# EasyEDA Pro project USB_TTL_CH340B.eprj

# Schematic Schematic1
Board Name: Board1; Create Date: 2024-12-27; Page Name: P1; Project Name: USB_TTL_CH340B; Schematic Name: Schematic1; Update Date: 2024-12-27; Company: 嘉立创EDA; Page Size: A4; Version: V1.0
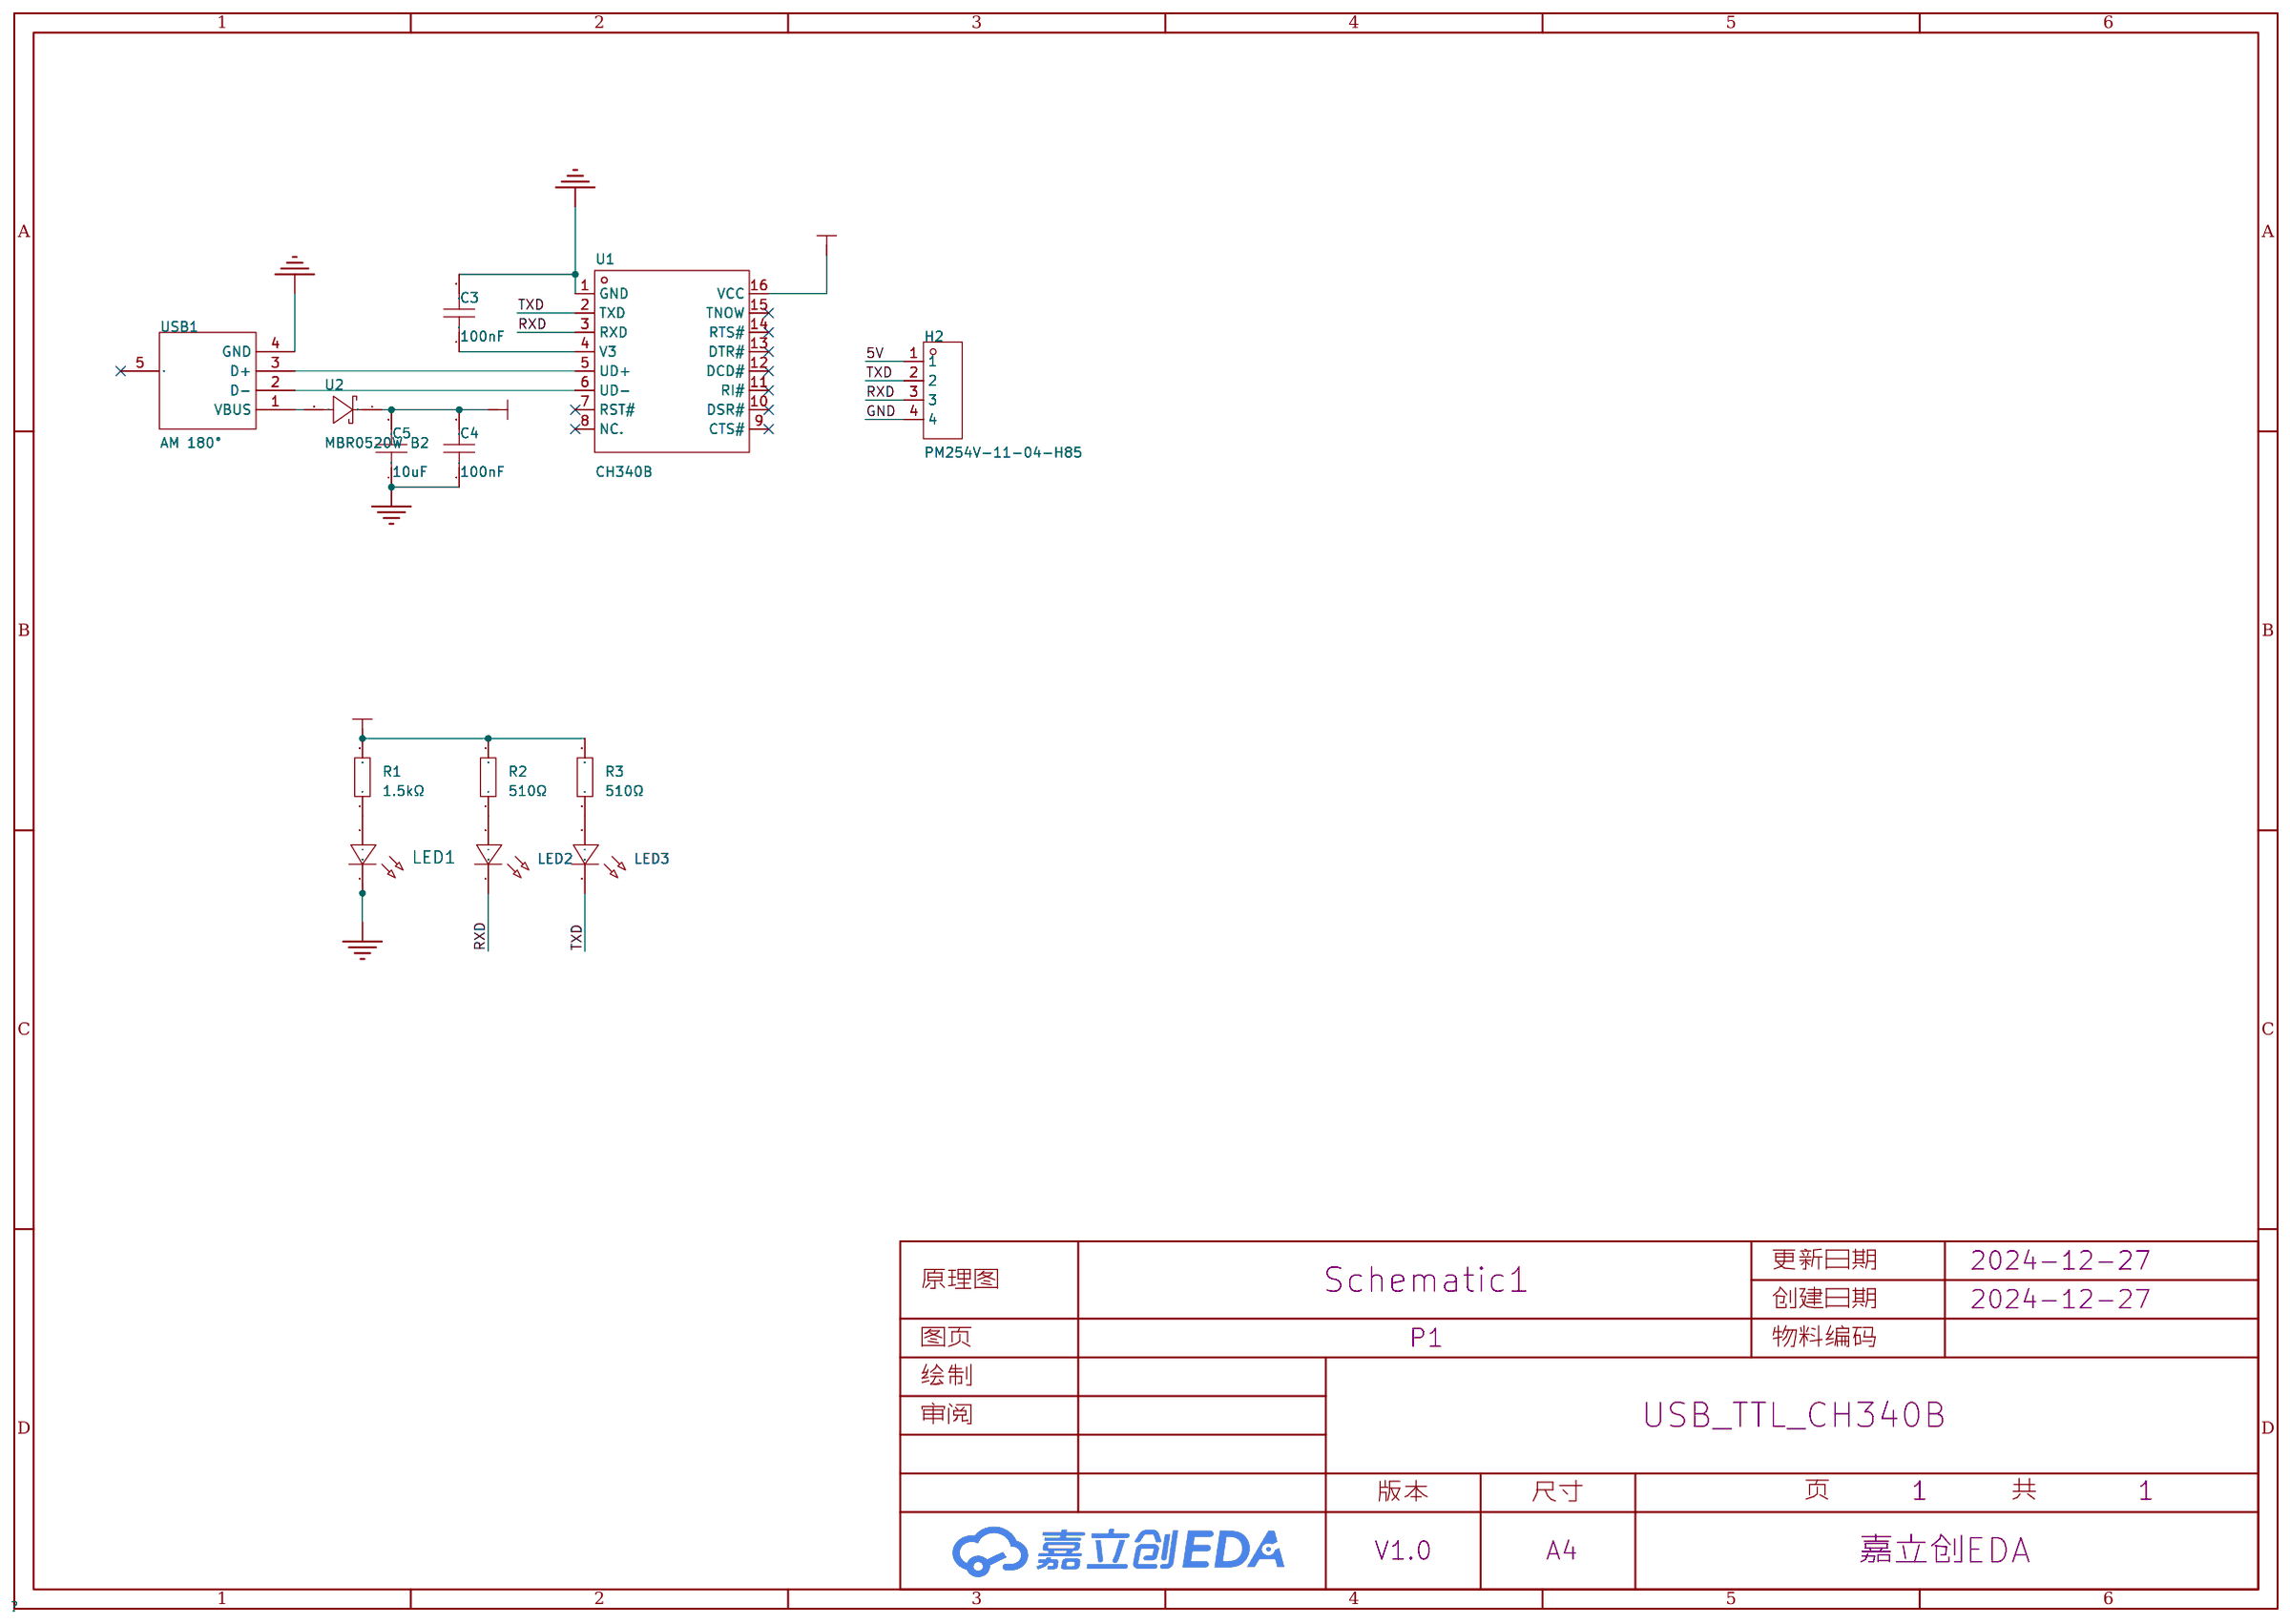
[diagram p0: schematic sheet]

## Parts
C3  100nF  [C0603]
C4  100nF  [C0603]
C5  10uF  [C0603]
H2  PM254V-11-04-H85  [HDR-TH_4P-P2.54-V-F]
LED1  -  [LED_0603]
LED2  -  [LED_0603]
LED3  -  [LED_0603]
R1  1.5kΩ  [R0603]
R2  510Ω  [R0603]
R3  510Ω  [R0603]
U1  CH340B  [SOIC-16_L9.9-W3.9-P1.27-LS6.0-BL]
U2  MBR0520W B2  [SOD-123_L2.7-W1.7-LS3.8-RD]
USB1  AM 180°  [USB-SMD_AM180]

## Library data of the parts
C3-C5 = CC0603KRX7R9BB104: 容值:100nF;精度:±10%;额定电压:50V;材质(温度系数):X7R;; LCSC Part Name: 100nF ±10% 50V; Supplier Part: C14663; Manufacturer: YAGEO(国巨); Supplier Footprint: 0603; JLCPCB Part Class: Basic Part; Datasheet: https://atta.szlcsc.com/upload/public/pdf/source/20180910/C282072_33301C7F631E79921B82A8DAC6BCC5B3.pdf; Supplier: LCSC; Tolerance: ±10%; Voltage Rated: 50V; Temperature Coefficient: X7R
H2 = PM254V-11-04-H85: LCSC Part Name: 2.54mm 1x4P; Supplier Part: C541851; Manufacturer: XFCN(兴飞); Supplier Footprint: 直插,P=2.54mm; JLCPCB Part Class: Extended Part; Datasheet: https://atta.szlcsc.com/upload/public/pdf/source/20200518/C541849_85853D71FC67C51915A806977A588FDA.pdf; Supplier: LCSC; Pitch: 2.54mm; Number of Holes: 4; Number of Rows: 1; Holes Structure: 1x4P; Mounting Type: 直插; Contact Material: 黄铜
LED1 = LED_0603-R: Supplier Footprint: 0603
LED2 = LED_0603-G: Supplier Footprint: 0603
LED3 = LED_0603-B: Supplier Footprint: 0603
R1-R3 = AF0603FR-071K5L: 电阻类型:厚膜电阻;阻值:1.5kΩ;精度:±1%;功率:100mW;最大工作电压:75V;温度系数:±100ppm/℃;; LCSC Part Name: 厚膜电阻 1.5kΩ ±1% 100mW; Supplier Part: C144088; Manufacturer: YAGEO(国巨); Supplier Footprint: 0603; JLCPCB Part Class: Extended Part; Datasheet: https://atta.szlcsc.com/upload/public/pdf/source/20180521/C192909_BA60B361D36B958A4E76614D266D209B.pdf; Supplier: LCSC; Type: 厚膜电阻; Tolerance: ±1%; Power(Watts): 100mW; Overload Voltage (Max): 75V; Temperature Coefficient: ±100ppm/℃; Operating Temperature Range: -55℃~+155℃
U1 = CH340B: Supplier Part: C81010; Manufacturer: WCH(南京沁恒); Supplier Footprint: SOP-16; JLCPCB Part Class: Extended Part; Datasheet: https://atta.szlcsc.com/upload/public/pdf/source/20240313/C9CDB4B2542990A8DD7A323D09462BC5.pdf; Supplier: LCSC; Applications Function: 收发器; Protocol: USB 2.0; Supply Voltage: 3.3V；5V; Data Rate: 2Mbps
U2 = MBR0520W B2: LCSC Part Name: 电压:20V 电流:500mA; Supplier Part: C2965564; Manufacturer: Slkor(萨科微); Supplier Footprint: SOD-123; JLCPCB Part Class: Extended Part; Datasheet: https://atta.szlcsc.com/upload/public/pdf/source/20220121/DA2582E478F99E574518FC7550548B59.pdf; Supplier: LCSC; Diode Configuration: 独立式; Forward Voltage (Vf@If): 390mV@0.5A; Reverse Voltage (Vr): 20V; Rectified Current: 500mA; Reverse Leakage Current (Ir): 250uA@20V
USB1 = AM 180°: LCSC Part Name: Type-A 公 卧贴; Supplier Part: C2681564; Manufacturer: SHOU HAN(首韩); Supplier Footprint: SMD; JLCPCB Part Class: Extended Part; Datasheet: https://atta.szlcsc.com/upload/public/pdf/source/20241210/0576FD7CB64C8B3BF0B19B6EB345F321.pdf; Supplier: LCSC; Connector Type: Type-A; Standard: USB 2.0; Gender: 公; Mounting Style: 卧贴; Number of Contacts: 4P; Number of Ports: 1; Current Rating - Power (Max): 1.5A; Rated Voltage (Max): 30V; Connect-Disconnect Life: 5千次; Length: 18.8mm; Core Colour: 白色; Operating Temperature Range: -25℃~+85℃

## Nets
5V: C4.2 C5.2 H2.1 R1.2 R2.2 R3.2 U1.16(VCC) U2.1(C)
GND: C3.2 C4.1 C5.1 H2.4 LED1.1(C) U1.1(GND) USB1.4(GND)
RXD: H2.3 LED2.1(C) U1.3(RXD)
TXD: H2.2 LED3.1(C) U1.2(TXD)
$1N830: LED1.2(A) R1.1
$1N832: LED2.2(A) R2.1
$1N833: LED3.2(A) R3.1
$1N961: U1.5(UD+) USB1.3(D+)
$1N965: U1.6(UD-) USB1.2(D-)
$1N970: U2.2(A) USB1.1(VBUS)
$1N1050: C3.1 U1.4(V3)

Not connected (* = marked no-connect by the designer): U1 7(RST#)* 8(NC.)* 9(CTS#)* 10(DSR#)* 11(RI#)* 12(DCD#)* 13(DTR#)* 14(RTS#)* 15(TNOW)*; USB1 5(EH)*

# Board PCB1
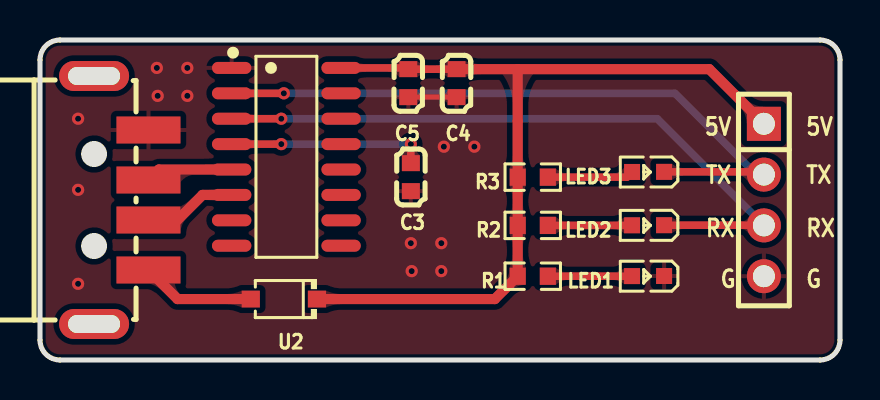
[diagram p1: board, top side]
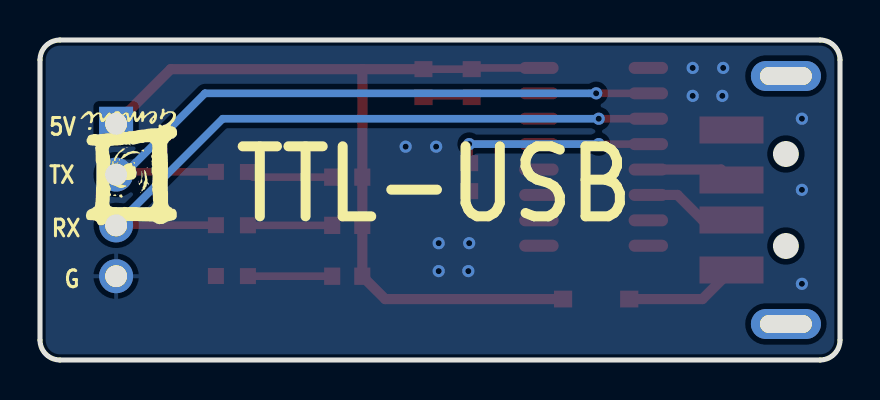
[diagram p2: board, bottom side, seen from below]

Outline 40 x 16 mm; copper layers: Top Layer, Bottom Layer. Coordinates in mm from the lower left corner of the outline.
Outline path: 0,15 0,1 arc(0.29,0.29) 1,0 39,0 arc(39.71,0.29) 40,1 40,15 arc(39.71,15.71) 39,16 1,16 arc(0.29,15.71) 0,15
Stack: Top Layer 0.035mm / Dielectric1 1.51mm FR4 er 4.5 / Bottom Layer 0.035mm

## Design rules (mm)
template: 自定义配置
spacing copperThickness1oz (default): track to track 0.152, other pairs 0.152 to 0.3
spacing copperThickness2oz: track to track 0.203, other pairs 0.152 to 0.3
track width copperThickness1oz (default): min 0.127, default 0.254, max 2.54
track width copperThickness2oz: min 0.203, default 0.254, max 2.54
differential pair differentialPair (default): width min 0.127, default 0.254, max 2.54; gap min 0.152, default 0.152
via viaSize (default): diameter min 0.5, default 0.61, max 10; hole min 0.3, default 0.305, max 6.3

## Placement (name value [footprint] x y rotation side)
C3  100nF  [C0603]  18.54 9.14 270 top
C4  100nF  [C0603]  20.83 13.84 90 top
C5  10uF  [C0603]  18.41 13.84 90 top
H2  PM254V-11-04-H85  [HDR-TH_4P-P2.54-V-F]  36.19 8 270 top
LED1  -  [LED_0603]  30.35 4.19 180 top
LED2  -  [LED_0603]  30.35 6.73 180 top
LED3  -  [LED_0603]  30.35 9.4 180 top
R1  1.5kΩ  [R0603]  24.64 4.19 180 top
R2  510Ω  [R0603]  24.64 6.73 180 top
R3  510Ω  [R0603]  24.64 9.14 180 top
U1  CH340B  [SOIC-16_L9.9-W3.9-P1.27-LS6.0-BL]  12.32 10.16 270 top
U2  MBR0520W B2  [SOD-123_L2.7-W1.7-LS3.8-RD]  12.19 3.05 180 top
USB1  AM 180°  [USB-SMD_AM180]  4.06 8 270 top

## Footprints (pads in the part's own frame, mm; a bottom-side part is the same pattern mirrored in y, then rotated)
C0603
  rect 0.8x0.9 smd: 1(-0.7,0) 2(0.7,0)
HDR-TH_4P-P2.54-V-F
  rect 1.7x1.7 hole 1.1: 1(-3.81,0)
  round 1.7 hole 1.1: 2(-1.27,0) 3(1.27,0) 4(3.81,0)
LED_0603
  rect 0.8x0.8 smd: 1(-0.851,-0.01) 2(0.75,-0.005)
R0603
  rect 0.806x0.864 smd: 1(-0.753,0) 2(0.753,0)
SOD-123_L2.7-W1.7-LS3.8-RD
  rect 0.91x0.84 smd: 1(-1.655,0) 2(1.655,0)
SOIC-16_L9.9-W3.9-P1.27-LS6.0-BL
  oval 0.602x1.971 smd: 1(-4.445,-2.736) 2(-3.175,-2.736) 3(-1.905,-2.736) 4(-0.635,-2.736) 5(0.635,-2.736) 6(1.905,-2.736) 7(3.175,-2.736) 8(4.445,-2.736) 9(4.445,2.736) 10(3.175,2.736) 11(1.905,2.736) 12(0.635,2.736) 13(-0.635,2.736) 14(-1.905,2.736) 15(-3.175,2.736) 16(-4.445,2.736)
USB-SMD_AM180
  rect 1.35x3.2 smd: 1(3.5,1.36) 2(1,1.36) 3(-1,1.36) 4(-3.5,1.36)
  oval 1.5x3.5 hole 0.9x2.6: 5(-6.2,-1.36) 5(6.2,-1.36)

## Nets
As in the schematic.

Pads without a net: U1 7 8 9 10 11 12 13 14 15; USB1 5

## Via types
v1: diameter 0.61, hole 0.305, Top Layer to Bottom Layer, 17 vias

## Routing (per net, layer and track width the routed paths; a pad name or vN(x,y) marks a point on that pad's centre or on a via; arc(x,y) is an arc through that point)
5V: length 43.2
  Top Layer w0.381: U1.16 18.35,14.6 C5.2 C4.2
  Top Layer w0.508: 23.88,14.54 R3.2 R2.2 R1.2 22.74,3.05 U2.1 ; 23.88,14.54 33.46,14.54 H2.1 ; 23.88,14.54 C4.2
GND: length 2.4
  Top Layer w0.254: C5.1 C4.1
  vias: v1(1.91,12.06) v1(1.91,8.51) v1(1.91,3.81) v1(5.84,14.6) v1(5.88,13.21) v1(7.37,14.6) v1(7.37,13.21) v1(18.54,5.84) v1(18.58,4.44) v1(20.07,5.84) v1(20.07,4.44) v1(20.19,10.67) v1(21.72,10.67)
RXD: length 33.8
  Top Layer w0.381: U1.3 v1(12.06,12.06) ; LED2.1 36.19,6.74 H2.3
  Bottom Layer w0.381: v1(12.06,12.06) 30.86,12.06 H2.3
TXD: length 33.3
  Top Layer w0.381: H2.2 36.06,9.41 LED3.1 ; U1.2 v1(12.19,13.33)
  Bottom Layer w0.381: v1(12.19,13.33) 31.75,13.33 35.81,9.27 H2.2
$1N830: length 4.2
  Top Layer w0.381: R1.1 29.6,4.19 LED1.2
$1N832: length 4.2
  Top Layer w0.381: R2.1 29.6,6.73 LED2.2
$1N833: length 4.3
  Top Layer w0.381: R3.1 29.34,9.14 LED3.2
$1N961: length 4.4
  Top Layer w0.508: USB1.3 5.95,9.52 U1.5
$1N965: length 4.7
  Top Layer w0.508: U1.6 8.13,8.25 6.87,7 USB1.2
$1N970: length 5.7
  Top Layer w0.508: U2.2 6.88,3.05 USB1.1
$1N1050: length 9.9
  Top Layer w0.381: U1.4 v1(12.06,10.79) ; v1(18.54,10.79) C3.1
  Bottom Layer w0.381: v1(12.06,10.79) v1(18.54,10.79)

## Copper pours and planes (outline as drawn; the poured copper is in the pictures)
GND on Top Layer: -2.54,19.05 43.81,19.05 43.81,-1.78 -2.54,-1.78
GND on Bottom Layer: -2.29,19.43 42.42,19.43 42.42,-2.16 -2.29,-2.16

Small or netless copper shapes (teardrops, artwork), in the pictures only: 40 on Top Layer, 6 on Bottom Layer

## Text on the board
Bottom Silkscreen Layer: G | RX | 5V | TX | TTL-USB
Top Silkscreen Layer: 5V | TX | RX | G
